# EAGLE schematic IR_RING_v12 (EAGLE 9.7.0)
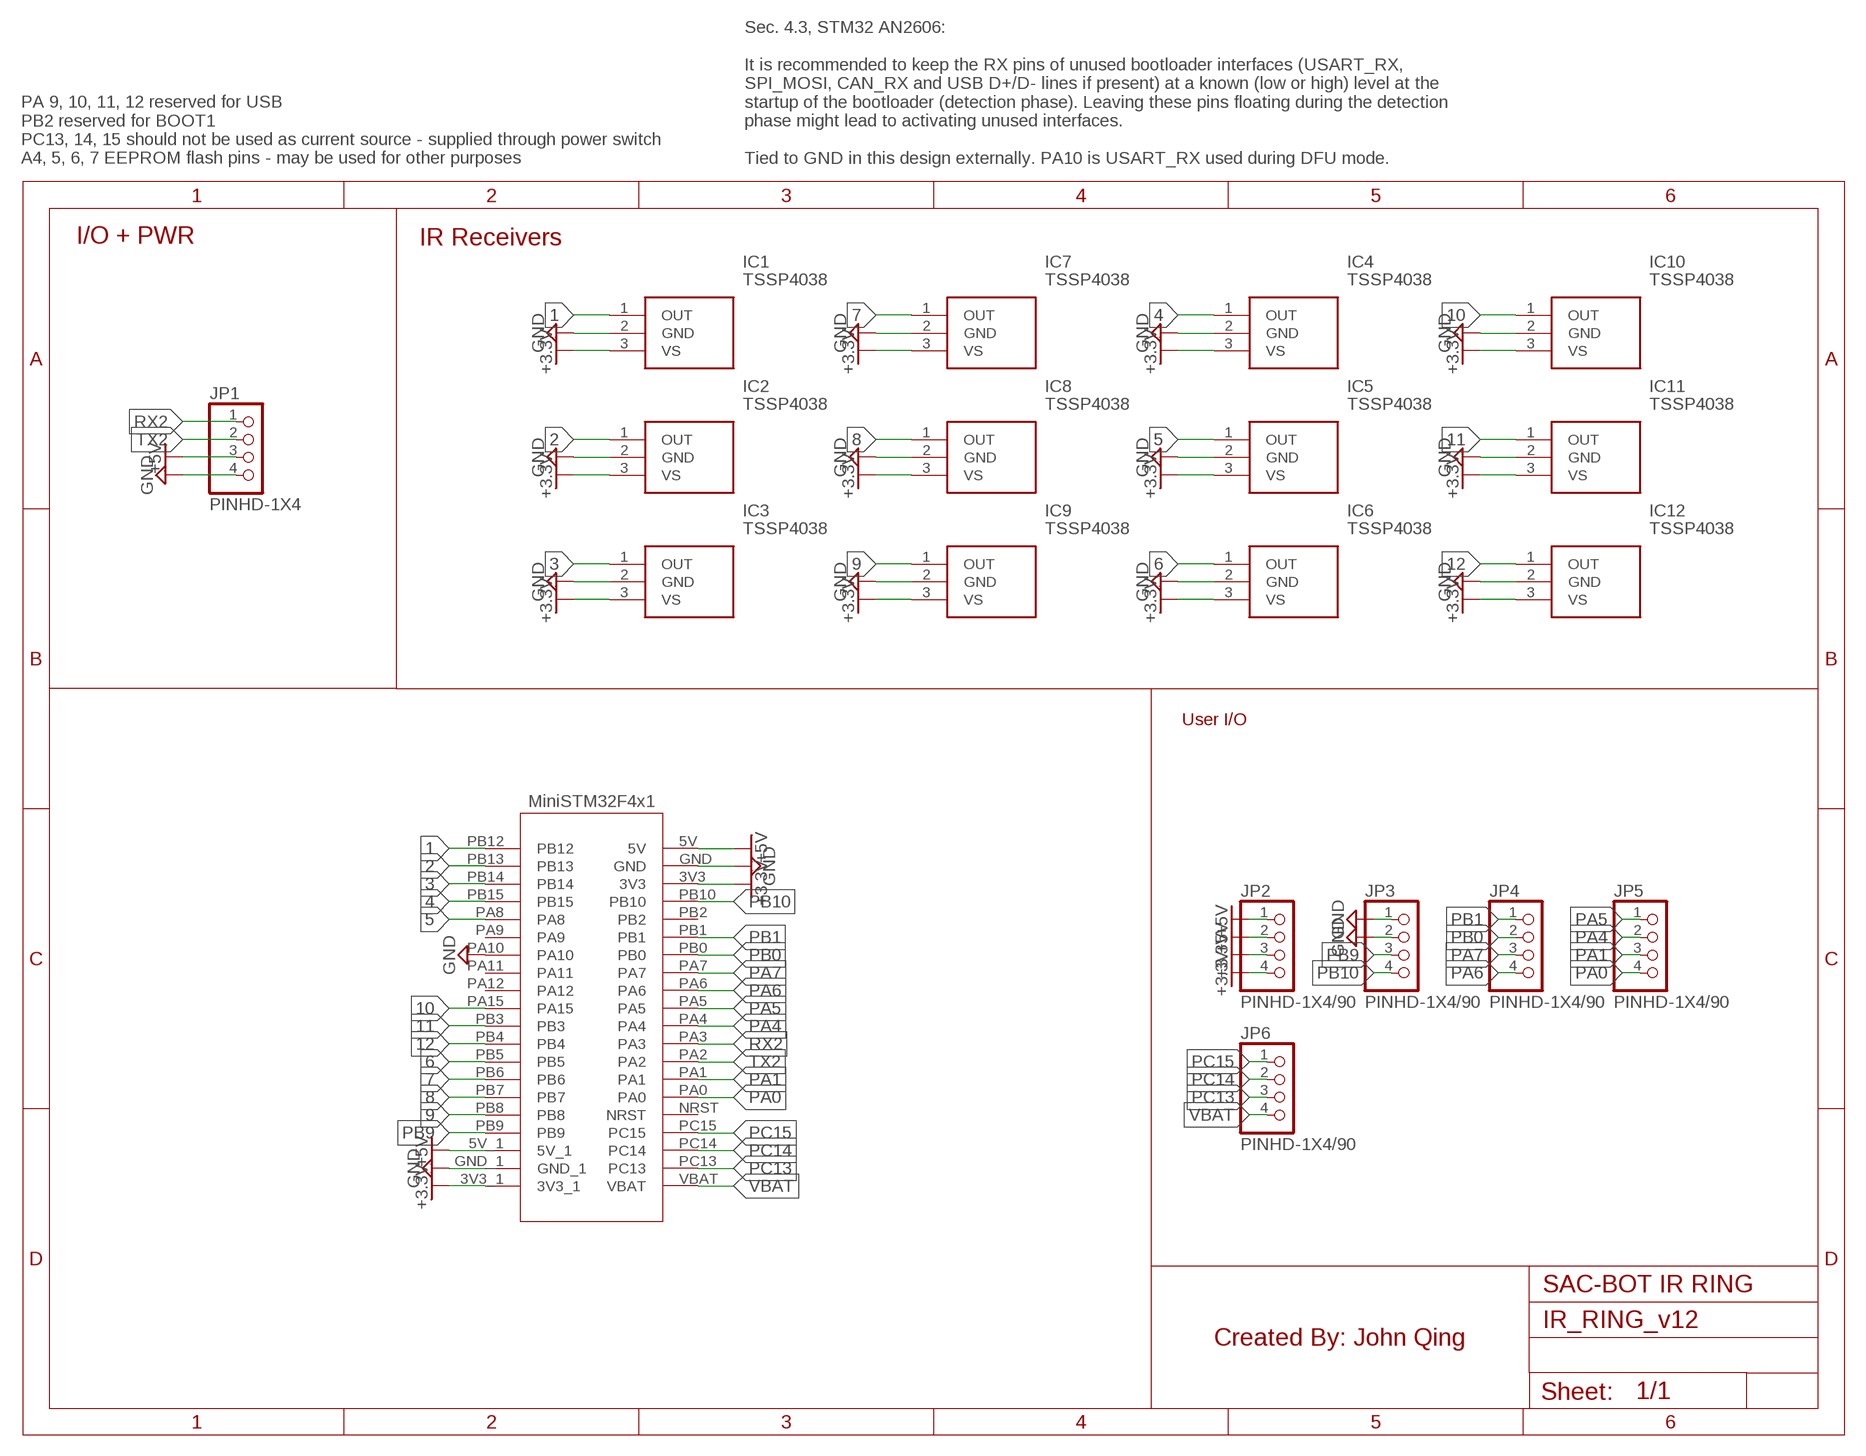
[diagram p0: schematic, sheet 1]

## Parts
IC1  TSSP4038  [TSSP4038]
IC2  TSSP4038  [TSSP4038]
IC3  TSSP4038  [TSSP4038]
IC4  TSSP4038  [TSSP4038]
IC5  TSSP4038  [TSSP4038]
IC6  TSSP4038  [TSSP4038]
IC7  TSSP4038  [TSSP4038]
IC8  TSSP4038  [TSSP4038]
IC9  TSSP4038  [TSSP4038]
IC10  TSSP4038  [TSSP4038]
IC11  TSSP4038  [TSSP4038]
IC12  TSSP4038  [TSSP4038]
JP1  PINHD-1X4  [1X04]
JP2  PINHD-1X4/90  [1X04/90]
JP3  PINHD-1X4/90  [1X04/90]
JP4  PINHD-1X4/90  [1X04/90]
JP5  PINHD-1X4/90  [1X04/90]
JP6  PINHD-1X4/90  [1X04/90]
U$1  MINISTM32F4X1  [MINISTM32F4X1]

## Nets
1: IC1.1(OUT) U$1.PB12
2: IC2.1(OUT) U$1.PB13
3: IC3.1(OUT) U$1.PB14
4: IC4.1(OUT) U$1.PB15
5: IC5.1(OUT) U$1.PA8
6: IC6.1(OUT) U$1.PB5
7: IC7.1(OUT) U$1.PB6
8: IC8.1(OUT) U$1.PB7
9: IC9.1(OUT) U$1.PB8
10: IC10.1(OUT) U$1.PA15
11: IC11.1(OUT) U$1.PB3
12: IC12.1(OUT) U$1.PB4
+3.3V: IC1.3(VS) IC2.3(VS) IC3.3(VS) IC4.3(VS) IC5.3(VS) IC6.3(VS) IC7.3(VS) IC8.3(VS) IC9.3(VS) IC10.3(VS) IC11.3(VS) IC12.3(VS) JP2.3 JP2.4 U$1.3V3 U$1.3V3_1
+5V: JP1.3 JP2.1 JP2.2 U$1.5V U$1.5V_1
GND: IC1.2(GND) IC2.2(GND) IC3.2(GND) IC4.2(GND) IC5.2(GND) IC6.2(GND) IC7.2(GND) IC8.2(GND) IC9.2(GND) IC10.2(GND) IC11.2(GND) IC12.2(GND) JP1.4 JP3.1 JP3.2 U$1.GND U$1.PA10
GND_1: U$1.GND_1 ; supply symbol labelled GND
PA0: JP5.4 U$1.PA0
PA1: JP5.3 U$1.PA1
PA4: JP5.2 U$1.PA4
PA5: JP5.1 U$1.PA5
PA6: JP4.4 U$1.PA6
PA7: JP4.3 U$1.PA7
PB0: JP4.2 U$1.PB0
PB1: JP4.1 U$1.PB1
PB9: JP3.3 U$1.PB9
PB10: JP3.4 U$1.PB10
PC13: JP6.3 U$1.PC13
PC14: JP6.2 U$1.PC14
PC15: JP6.1 U$1.PC15
RX2: JP1.1 U$1.PA3
TX2: JP1.2 U$1.PA2
VBAT: JP6.4 U$1.VBAT
Unconnected: U$1.NRST U$1.PA9 U$1.PA11 U$1.PA12 U$1.PB2

## Notes on the sheet
- PA 9, 10, 11, 12 reserved for USB
  PB2 reserved for BOOT1
  PC13, 14, 15 should not be used as current source - supplied through power switch
  A4, 5, 6, 7 EEPROM flash pins - may be used for other purposes
- Sec. 4.3, STM32 AN2606:
  
  It is recommended to keep the RX pins of unused bootloader interfaces (USART_RX,
  SPI_MOSI, CAN_RX and USB D+/D- lines if present) at a known (low or high) level at the
  startup of the bootloader (detection phase). Leaving these pins floating during the detection
  phase might lead to activating unused interfaces.
  
  Tied to GND in this design externally. PA10 is USART_RX used during DFU mode.
- I/O + PWR | IR Receivers
- User I/O
- SAC-BOT IR RING
- Created By: John Qing

## Library data of the parts
IC1-IC12 = TSSP4038:TSSP4038: IR Receiver Module 38KHz 25m EMI 3-Pin Vishay TSSP4038, 38kHz IR Receiver, 950nm +/-45 , 25m Range, 2.5V - 5V, Through Hole, 6 x 3.9 x 6.95mm Source: Datasheet <https://componentsearchengine.com/Datasheets/2/TSSP4038.pdf>; DESCRIPTION: IR Receiver Module 38KHz 25m EMI 3-Pin Vishay TSSP4038, 38kHz IR Receiver, 950nm +/-45 , 25m Range, 2.5V - 5V, Through Hole, 6 x 3.9 x 6.95mm; HEIGHT: mm; MANUFACTURER_NAME: Vishay; MANUFACTURER_PART_NUMBER: TSSP4038; MOUSER_PART_NUMBER: 782-TSSP4038; MOUSER_PRICE-STOCK: https://www.mouser.co.uk/ProductDetail/Vishay-Semiconductors/TSSP4038?qs=lgjwDzixuo3Ja5hn%252BEmOdw%3D%3D
JP1 = Connector:PINHD-1X4: PIN HEADER; CATEGORY: Headers; DESCRIPTION: Header, Straight, 4 Position; MANUFACTURER: Generic; MPN: Generic; OPERATING_TEMPERATURE: Generic; PART_STATUS: Active; PITCH: 0.100" (2.54mm); ROHS_COMPLIANCE: Generic; SERIES: Generic; SUB-CATEGORY: Headers, Male Pins; TYPE: Board to Board or Cable, Unshrouded, Through Hole, Straight
JP2-JP6 = Connector:PINHD-1X4: PIN HEADER; CATEGORY: Headers; DESCRIPTION: Header, Right Angle, 4 Position; MANUFACTURER: Generic; MPN: Generic; OPERATING_TEMPERATURE: Generic; PART_STATUS: Active; PITCH: 0.100" (2.54mm); ROHS_COMPLIANCE: Generic; SERIES: Generic; SUB-CATEGORY: Headers, Male Pins; TYPE: Board to Board or Cable, Unshrouded, Through Hole, Right Angle
U$1 = MiniSTM32F4x1:MINISTM32F4X1